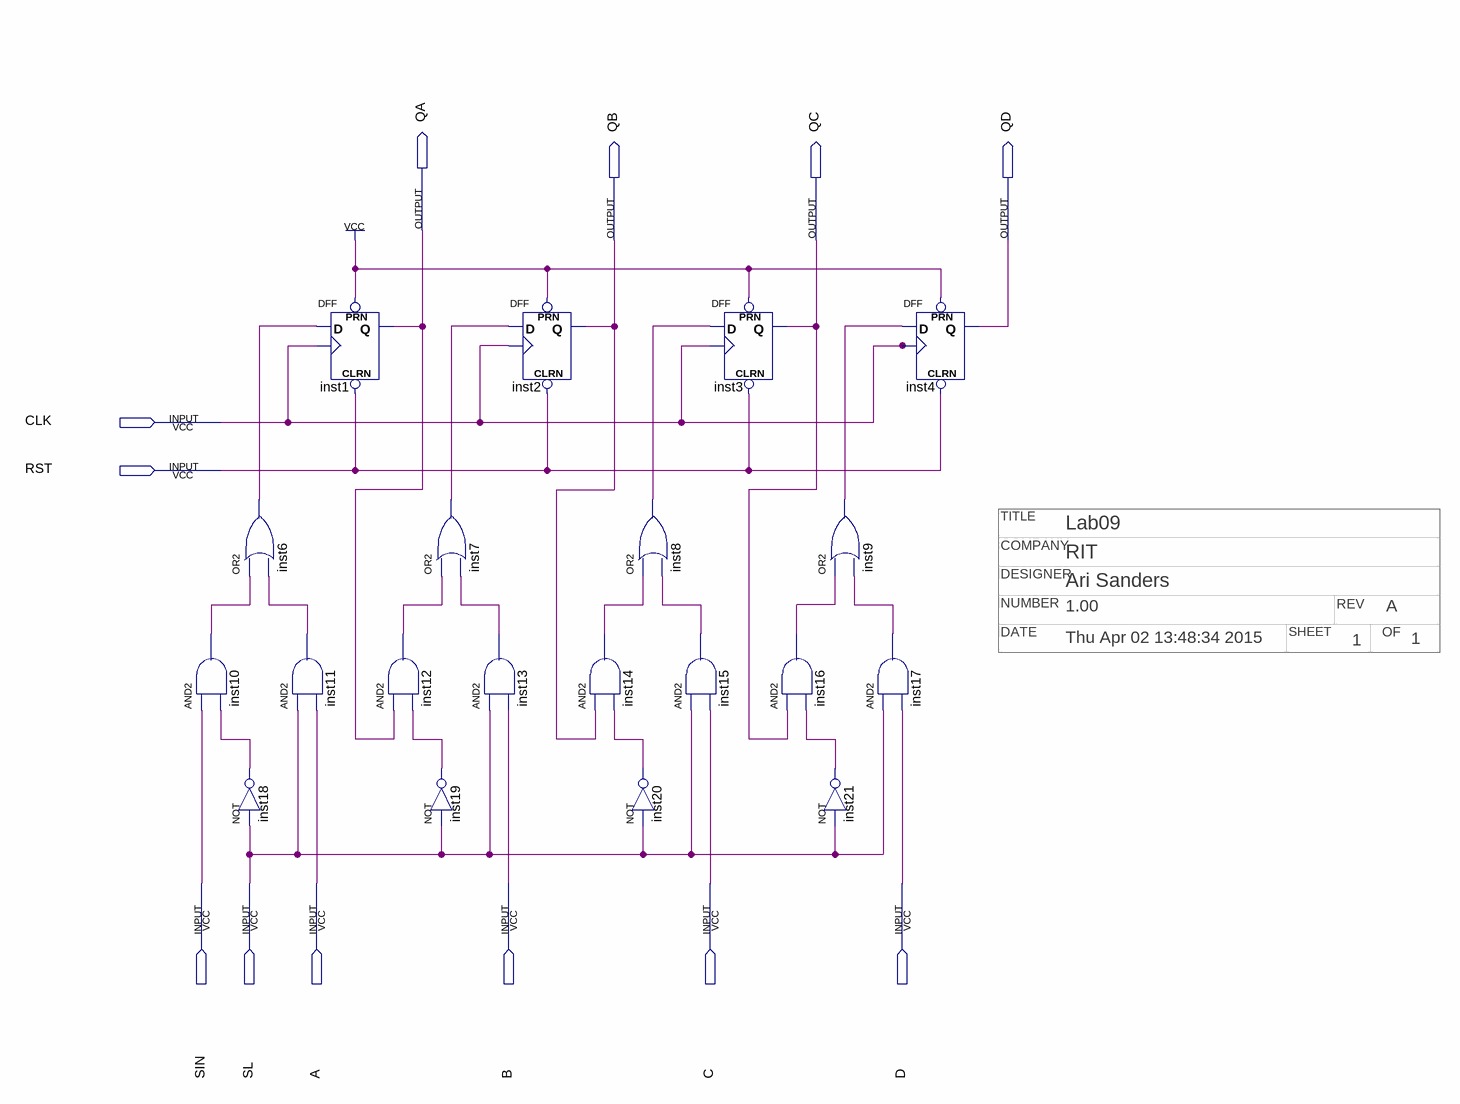
[diagram p0: schematic sheet]
// Quartus schematic Lab09.bdf as structural Verilog: 20 symbols, 12 pins
// Title block: COMPANY: RIT; DATE: Thu Apr 02 13:48:34 2015; DESIGNER: Ari Sanders; NUMBER: 1.00; OF: 1; REV: A; SHEET: 1; TITLE: Lab09
module Lab09 (
  input  CLK,
  input  RST,
  input  SIN,
  input  SL,
  input  A,
  input  B,
  input  C,
  input  D,
  output QA,
  output QB,
  output QC,
  output QD
);

  wire inst6_out, inst7_out, inst8_out, inst9_out, inst10_out, inst11_out, inst12_out, inst13_out,
       inst14_out, inst15_out, inst16_out, inst17_out, inst18_out, inst19_out, inst20_out, inst21_out;

  and inst10 (inst10_out, SIN, inst18_out);
  or inst6 (inst6_out, inst10_out, inst11_out);
  and inst11 (inst11_out, SL, A);
  not inst18 (inst18_out, SL);
  DFF inst1 (.CLRN(RST), .CLK(CLK), .D(inst6_out), .PRN(1'b1), .Q(QA));
  or inst7 (inst7_out, inst12_out, inst13_out);
  and inst12 (inst12_out, QA, inst19_out);
  not inst19 (inst19_out, SL);
  DFF inst2 (.CLRN(RST), .CLK(CLK), .D(inst7_out), .PRN(1'b1), .Q(QB));
  and inst13 (inst13_out, SL, B);
  and inst14 (inst14_out, QB, inst20_out);
  or inst8 (inst8_out, inst14_out, inst15_out);
  and inst15 (inst15_out, SL, C);
  not inst20 (inst20_out, SL);
  DFF inst3 (.CLRN(RST), .CLK(CLK), .D(inst8_out), .PRN(1'b1), .Q(QC));
  or inst9 (inst9_out, inst16_out, inst17_out);
  and inst16 (inst16_out, QC, inst21_out);
  not inst21 (inst21_out, SL);
  DFF inst4 (.CLRN(RST), .CLK(CLK), .D(inst9_out), .PRN(1'b1), .Q(QD));
  and inst17 (inst17_out, SL, D);
endmodule
